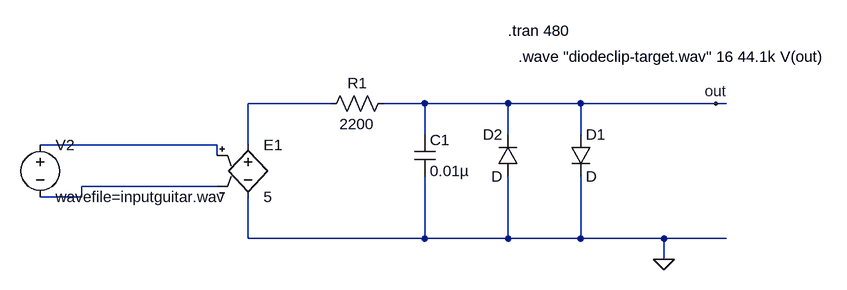
[diagram p0: schematic DiodeClipper.asc]
DiodeClipper.asc, the LTspice schematic file:
Version 4
SHEET 1 1056 680
WIRE 176 160 48 160
WIRE 320 160 256 160
WIRE 448 160 320 160
WIRE 560 160 448 160
WIRE 768 160 560 160
WIRE 784 160 768 160
WIRE 320 208 320 160
WIRE 448 208 448 160
WIRE 560 208 560 160
WIRE 0 224 -272 224
WIRE 48 224 48 160
WIRE 0 240 0 224
WIRE 0 288 -208 288
WIRE -208 304 -208 288
WIRE -208 304 -272 304
WIRE 48 368 48 304
WIRE 320 368 320 272
WIRE 320 368 48 368
WIRE 448 368 448 272
WIRE 448 368 320 368
WIRE 560 368 560 272
WIRE 560 368 448 368
WIRE 688 368 560 368
WIRE 784 368 688 368
WIRE 688 400 688 368
FLAG 688 400 0
FLAG 768 160 out
SYMBOL res 272 144 R90
WINDOW 0 0 56 VBottom 2
WINDOW 3 32 56 VTop 2
SYMATTR InstName R1
SYMATTR Value 2200
SYMBOL diode 544 208 R0
SYMATTR InstName D1
SYMBOL diode 464 272 R180
WINDOW 0 24 64 Left 2
WINDOW 3 24 0 Left 2
SYMATTR InstName D2
SYMBOL cap 304 208 R0
SYMATTR InstName C1
SYMATTR Value 0.01µ
SYMBOL voltage -272 208 R0
SYMATTR InstName V2
SYMATTR Value wavefile=inputguitar.wav
SYMBOL e 48 208 R0
SYMATTR InstName E1
SYMATTR Value 5
TEXT 448 48 Left 2 !.tran 480
TEXT 464 88 Left 2 !.wave "diodeclip-target.wav" 16 44.1k V(out)

The netlist it stands for:
* DiodeClipper.asc
R1 out N001 2200
D1 out 0 D
D2 0 out D
C1 out 0 0.01µ
V2 N002 N003 wavefile=inputguitar.wav
E1 N001 0 N002 N003 5
.model D D
.lib standard.dio
.tran 480
.wave "diodeclip-target.wav" 16 44.1k V(out)
.backanno
.end